# Altium schematic sheet Display.SchDoc
size A4
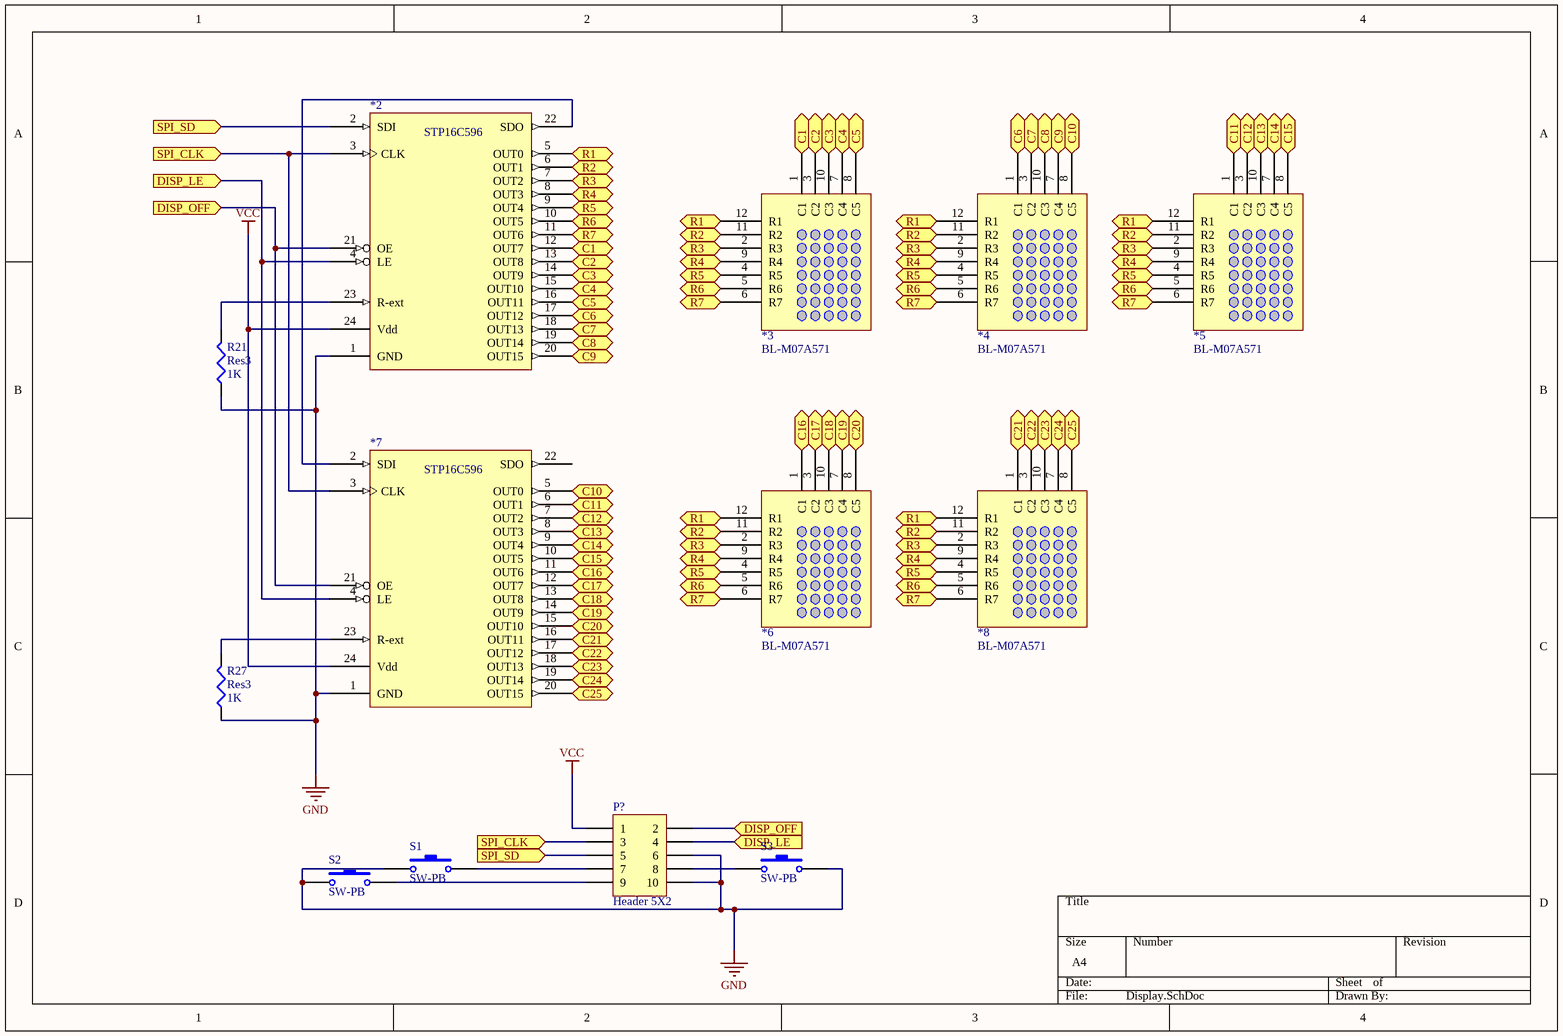
[diagram p0: Display.SchDoc]

## Parts
*2  STP16C596  [DB024]
*3  BL-M07A571  [LED matrix 7x5]
*4  BL-M07A571  [LED matrix 7x5]
*5  BL-M07A571  [LED matrix 7x5]
*6  BL-M07A571  [LED matrix 7x5]
*7  STP16C596  [DB024]
*8  BL-M07A571  [LED matrix 7x5]
P?  Header 5X2  [HDR2X5]
R21  Res3  value 1K  [RESC1608L]
R27  Res3  value 1K  [RESC1608L]
S1  SW-PB  [SPST-2]
S2  SW-PB  [SPST-2]
S3  SW-PB  [SPST-2]

## Ports
C1, C2, C3, C4, C5, C6, C7, C8, C9, C10, C11, C12, C13, C14, C15, C16, C17, C18, C19, C20, C21, C22, C23, C24, C25, DISP_LE (in), DISP_OFF (in), R1, R2, R3, R4, R5, R6, R7, SPI_CLK (in), SPI_SD (in)

## Nets
GND: *2.1(GND) *7.1(GND) P?.6 P?.10 R21.1 R27.1 S1.1 S2.1 S3.2
VCC: *2.24(Vdd) *7.24(Vdd) P?.1
C1: *2.12(OUT7) *3.1(C1) ; port C1
C2: *2.13(OUT8) *3.3(C2) ; port C2
C3: *2.14(OUT9) *3.10(C3) ; port C3
C4: *2.15(OUT10) *3.7(C4) ; port C4
C5: *2.16(OUT11) *3.8(C5) ; port C5
C6: *2.17(OUT12) *4.1(C1) ; port C6
C7: *2.18(OUT13) *4.3(C2) ; port C7
C8: *2.19(OUT14) *4.10(C3) ; port C8
C9: *2.20(OUT15) *4.7(C4) ; port C9
C10: *4.8(C5) *7.5(OUT0) ; port C10
C11: *5.1(C1) *7.6(OUT1) ; port C11
C12: *5.3(C2) *7.7(OUT2) ; port C12
C13: *5.10(C3) *7.8(OUT3) ; port C13
C14: *5.7(C4) *7.9(OUT4) ; port C14
C15: *5.8(C5) *7.10(OUT5) ; port C15
C16: *6.1(C1) *7.11(OUT6) ; port C16
C17: *6.3(C2) *7.12(OUT7) ; port C17
C18: *6.10(C3) *7.13(OUT8) ; port C18
C19: *6.7(C4) *7.14(OUT9) ; port C19
C20: *6.8(C5) *7.15(OUT10) ; port C20
C21: *7.16(OUT11) *8.1(C1) ; port C21
C22: *7.17(OUT12) *8.3(C2) ; port C22
C23: *7.18(OUT13) *8.10(C3) ; port C23
C24: *7.19(OUT14) *8.7(C4) ; port C24
C25: *7.20(OUT15) *8.8(C5) ; port C25
DISP_LE: *2.4(LE) *7.4(LE) P?.4 ; port DISP_LE
DISP_OFF: *2.21(OE) *7.21(OE) P?.2 ; port DISP_OFF
R1: *2.5(OUT0) *3.12(R1) *4.12(R1) *5.12(R1) *6.12(R1) *8.12(R1) ; port R1
R2: *2.6(OUT1) *3.11(R2) *4.11(R2) *5.11(R2) *6.11(R2) *8.11(R2) ; port R2
R3: *2.7(OUT2) *3.2(R3) *4.2(R3) *5.2(R3) *6.2(R3) *8.2(R3) ; port R3
R4: *2.8(OUT3) *3.9(R4) *4.9(R4) *5.9(R4) *6.9(R4) *8.9(R4) ; port R4
R5: *2.9(OUT4) *3.4(R5) *4.4(R5) *5.4(R5) *6.4(R5) *8.4(R5) ; port R5
R6: *2.10(OUT5) *3.5(R6) *4.5(R6) *5.5(R6) *6.5(R6) *8.5(R6) ; port R6
R7: *2.11(OUT6) *3.6(R7) *4.6(R7) *5.6(R7) *6.6(R7) *8.6(R7) ; port R7
SPI_CLK: *2.3(CLK) *7.3(CLK) P?.3 ; port SPI_CLK
SPI_SD: *2.2(SDI) P?.5 ; port SPI_SD
Net*2_22: *2.22(SDO) *7.2(SDI)
Net*2_23: *2.23(R-ext) R21.2
Net*7_23: *7.23(R-ext) R27.2
NetP?_7: P?.7 S1.2
NetP?_8: P?.8 S3.1
NetP?_9: P?.9 S2.2

Not connected (* = marked no-connect by the designer): *7 22(SDO)

## Library data of the parts
P? = Header 5X2: Header, 5-Pin, Dual row; LatestRevisionDate: 17-Jul-2002; LatestRevisionNote: Re-released for DXP Platform.; Publisher: Altium Limited
R21 R27 = Res3: Resistor; Published: 8-Jun-2000; LatestRevisionDate: 29-May-2009; LatestRevisionNote: IPC-7351 Footprint Added.; PackageReference: J1-0603; Publisher: Altium Limited; PackageDescription: Chip Resistor
S1-S3 = SW-PB: Switch; Published: 24-Mar-1999; LatestRevisionDate: 17-Jul-2002; LatestRevisionNote: Re-released for DXP Platform.; PackageReference: SPST-2; Publisher: Altium Limited